# Altium project Capstone Control Board.PrjPcb
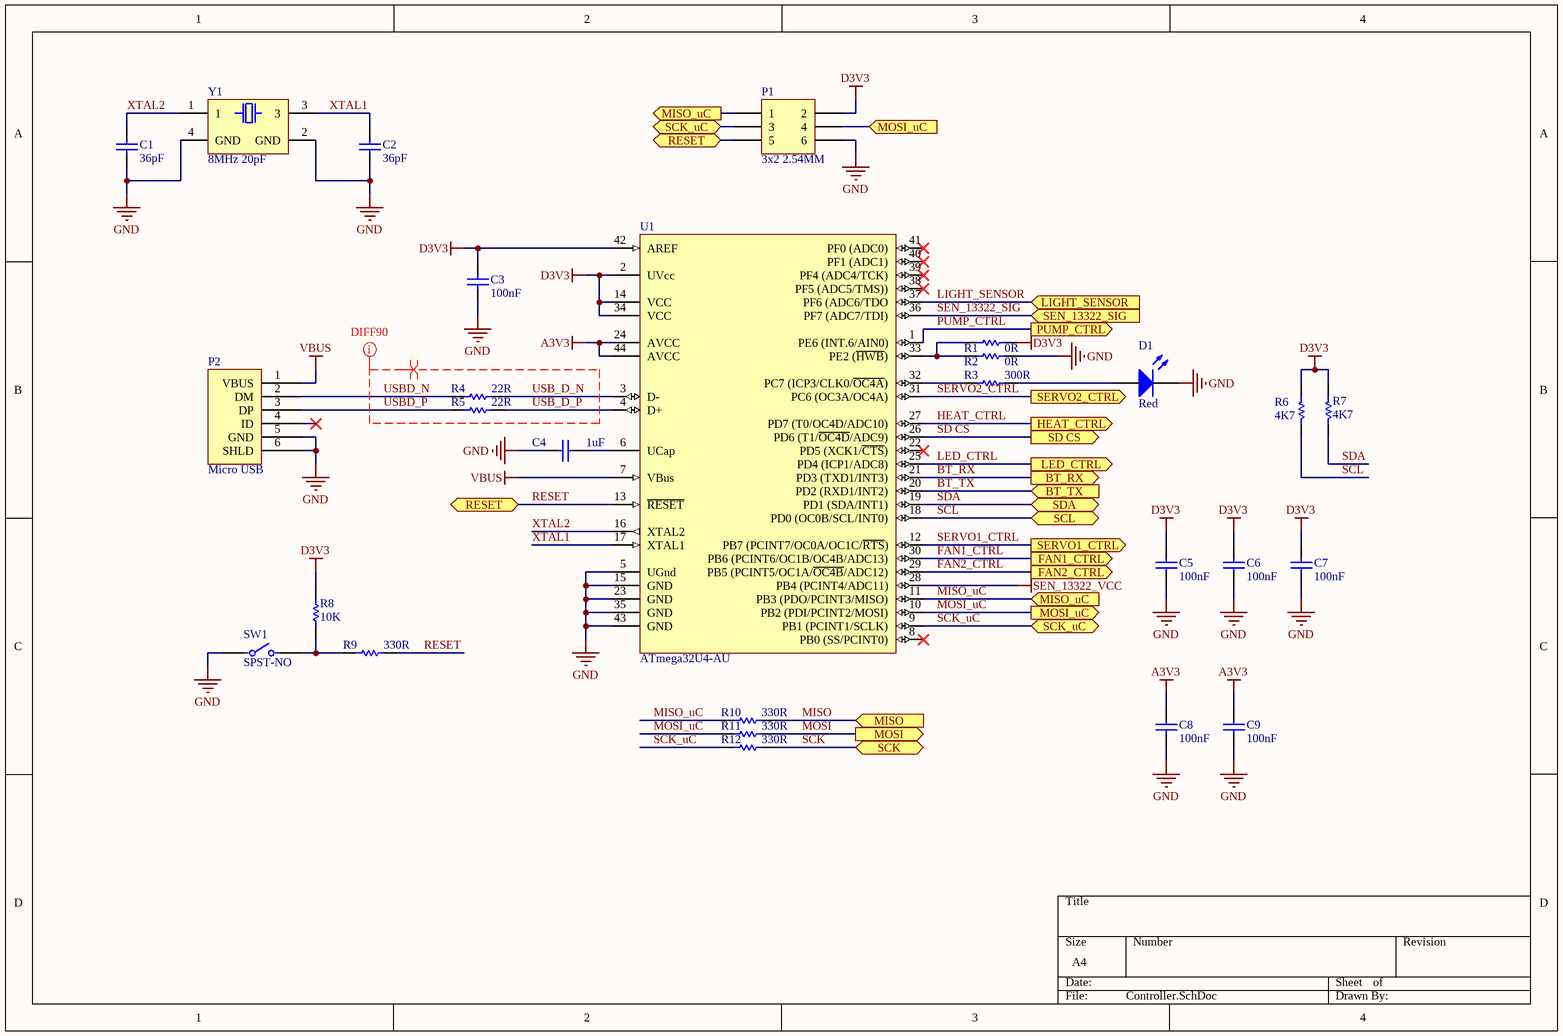
[diagram p0: Controller.SchDoc]
4 sheets, 100 parts. Net scope: flat (ports and power ports of the same name join across sheets).
Board file: Capstone Control Board.PcbDoc
Sheets:
  Controller.SchDoc
  Peripherals.SchDoc
  Sensors.SchDoc
  Power.SchDoc

## Sheet Controller.SchDoc
size A4

### Parts
C1  36pF  [CAP0603]
C2  36pF  [CAP0603]
C3  100nF  [CAP0603]
C4  1uF  [CAP0603]
C5  100nF  [CAP0603]
C6  100nF  [CAP0603]
C7  100nF  [CAP0603]
C8  100nF  [CAP0603]
C9  100nF  [CAP0603]
D1  Red  [DIODE0603]
P1  3x2 2.54MM  [HDR2X3]
P2  Micro USB  [MOLEX MICRO USB PORT]
R1  0R  [RES0603]
R2  0R  [RES0603]
R3  300R  [RES0603]
R4  22R  [RES0603]
R5  22R  [RES0603]
R6  4K7  [RES0603]
R7  4K7  [RES0603]
R8  10K  [RES0603]
R9  330R  [RES0603]
R10  330R  [RES0603]
R11  330R  [RES0603]
R12  330R  [RES0603]
SW1  SPST-NO  [Tactile SPST-NO Switch]
U1  ATmega32U4-AU  [44ML_M]
Y1  8MHz 20pF  [3225 XTAL]

### Ports
BT_RX (out), BT_TX (in), FAN1_CTRL (out), FAN2_CTRL (out), HEAT_CTRL (out), LED_CTRL (out), LIGHT_SENSOR (in), MISO (in), MISO_uC (in), MISO_uC (out), MOSI (out), MOSI_uC (in), MOSI_uC (out), PUMP_CTRL (out), RESET (bidir), SCK (bidir), SCK_uC (bidir), SCL (bidir), SD CS (out), SDA (bidir), SEN_13322_SIG (in), SERVO1_CTRL (out), SERVO2_CTRL (out)

### Nets
A3V3: C8.2 C9.2 U1.24(AVCC) U1.44(AVCC)
D3V3: C3.2 C5.2 C6.2 C7.2 P1.2 R1.2 R6.2 R7.2 R8.2 U1.2(UVcc) U1.14(VCC) U1.34(VCC) U1.42(AREF)
GND: C1.1 C2.1 C3.1 C4.1 C5.1 C6.1 C7.1 C8.1 C9.1 D1.2(K) P1.6 P2.5(GND) P2.6(SHLD) R2.2 SW1.1 U1.5(UGnd) U1.15(GND) U1.23(GND) U1.35(GND) U1.43(GND) Y1.2(GND) Y1.4(GND)
SEN_13322_VCC: U1.28(PB4_(PCINT4/ADC11))
VBUS: P2.1(VBUS) U1.7(VBus)
BT_RX: U1.21(PD3_(TXD1/INT3)) ; port BT_RX
BT_TX: U1.20(PD2_(RXD1/INT2)) ; port BT_TX
FAN1_CTRL: U1.30(PB6_(PCINT6/OC1B/OC4B/ADC13)) ; port FAN1_CTRL
FAN2_CTRL: U1.29(PB5_(PCINT5/OC1A/~{OC4B}/ADC12)) ; port FAN2_CTRL
HEAT_CTRL: U1.27(PD7_(T0/OC4D/ADC10)) ; port HEAT_CTRL
LED_CTRL: U1.25(PD4_(ICP1/ADC8)) ; port LED_CTRL
LIGHT_SENSOR: U1.37(PF6_(ADC6/TDO) ; port LIGHT_SENSOR
MISO: R10.1 ; port MISO
MISO_uC: P1.1 R10.2 U1.11(PB3_(PDO/PCINT3/MISO)) ; port MISO_uC
MOSI: R11.1 ; port MOSI
MOSI_uC: P1.4 R11.2 U1.10(PB2_(PDI/PCINT2/MOSI)) ; port MOSI_uC
PUMP_CTRL: U1.1(PE6_(INT.6/AIN0)) ; port PUMP_CTRL
RESET: P1.5 R9.1 U1.13(~{RESET}) ; port RESET
SCK: R12.1 ; port SCK
SCK_uC: P1.3 R12.2 U1.9(PB1_(PCINT1/SCLK)) ; port SCK_uC
SCL: R6.1 U1.18(PD0_(OC0B/SCL/INT0)) ; port SCL
SD CS: U1.26(PD6_(T1/~{OC4D}/ADC9)) ; port SD CS
SDA: R7.1 U1.19(PD1_(SDA/INT1)) ; port SDA
SEN_13322_SIG: U1.36(PF7_(ADC7/TDI)) ; port SEN_13322_SIG
SERVO1_CTRL: U1.12(PB7_(PCINT7/OC0A/OC1C/~{RTS})) ; port SERVO1_CTRL
SERVO2_CTRL: U1.31(PC6_(OC3A/OC4A)) ; port SERVO2_CTRL
USB_D_N: R4.2 U1.3(D-)
USB_D_P: R5.2 U1.4(D+)
USBD_N: P2.2(DM) R4.1
USBD_P: P2.3(DP) R5.1
XTAL1: C2.2 U1.17(XTAL1) Y1.3
XTAL2: C1.2 U1.16(XTAL2) Y1.1
NetC4_2: C4.2 U1.6(UCap)
NetD1_1: D1.1(A) R3.1
NetR1_1: R1.1 R2.1 U1.33(PE2_(~{HWB}))
NetR3_2: R3.2 U1.32(PC7_(ICP3/CLK0/~{OC4A}))
NetR8_1: R8.1 R9.2 SW1.2

Not connected (* = marked no-connect by the designer): P2 4(ID)*; U1 8(PB0_(SS/PCINT0))* 22(PD5_(XCK1/~{CTS}))* 38(PF5_(ADC5/TMS)))* 39(PF4_(ADC4/TCK))* 40(PF1_(ADC1))* 41(PF0_(ADC0))*

### Layout directives
differential pair: USB_D_N, USB_D_P, USBD_N, USBD_P
net class USB: USB_D_N, USB_D_P, USBD_N, USBD_P

### Library data of the parts
C1-C9 = Capacitor: Published: 8-Jun-2000; LatestRevisionDate: 17-Jul-2002; LatestRevisionNote: Re-released for DXP Platform.; PackageReference: RAD-0.3; Publisher: Altium Limited; PackageDescription: Radial Cap, Thru-Hole; 2 Leads; 0.3 in Pin Spacing; Value: Value
D1 = LED: Light Emitting Diode; Published: 8-Jun-2000; LatestRevisionDate: 17-Jul-2002; LatestRevisionNote: Re-released for DXP Platform.; PackageVersion: Sep-1996; PackageReference: SMC; Publisher: Altium Limited; PackageDescription: DO-214-AB/SMC; 2 C-Bend Leads; Body 7.9 x 5.9 mm, inc. leads (LxW); Code_JEDEC: DO-214-AB
P1 = 3x2 2.54MM: Header, 3-Pin, Dual row; LatestRevisionDate: 17-Jul-2002; LatestRevisionNote: Re-released for DXP Platform.; Publisher: Altium Limited
P2 = Micro USB Connector
R1-R12 = Resistor: Published: 8-Jun-2000; LatestRevisionDate: 17-Jul-2002; LatestRevisionNote: Re-released for DXP Platform.; PackageReference: AXIAL-0.3; Publisher: Altium Limited; PackageDescription: Axial Device, Thru-Hole; 2 Leads; 0.3 in Pin Spacing; Value: Value
SW1 = B3U-1000P-B: SPST-NO Switch SMD; Manufacturer: Omron; Operating Force: 1.5N; Voltage Rating Dc: 12V; Contact Current Rating: 50mA; Contact Resistance: 100mΩ; Electromechanical Life: 200000Cycles; Height: 1.75mm; Device Class L2: Switches; Temperature Range High: +70°C; Digikey Description: SWITCH TACTILE SPST-NO 0.05A 12V; Throw Configuration: SPST-NO; Ambient Temperature Range High: +70°C; Temperature: -25°C to +70°C; Lead Free: Yes; ComponentLink2URL: https://omronfs.omron.com/en_US/ecb/products/pdf/en-b3u.pdf; Device Class L3: Tactile Switches; Manufacturer Part Number: B3U-1000P-B; Ambient Temperature Range Low: -25°C; Mount: Surface Mount; Automotive: No; Mouser Description: Tactile Switches Top Actuated with boss w/o ground; Octopart: https://octopart.com/b3u-1000p-b-omron-1057356; RoHS: TRUE; Package: 0; Device Class L1: Electromechanical; Category: Switch; Temperature Range Low: -25°C; ComponentLink2Description: Datasheet
U1 = CMP-0095-00285-2: 8-bit AVR Microcontroller, 2.7-5.5V, 16MHz, 32KB Flash, 1KB EEPROM, 2.5KB SRAM, USB Controller, 44-pin TQFP, Industrial Grade (-40°C to 85°C), Ext Osc; RevisionNote: DatasheetVersion updated. URLs added.; ComponentLink1Description: Manufacturer URL; PackageDescription: 44-Pin Plastic Thin Quad Flat Pack, 10 x 10 x 1.0 mm Body, 0.8 mm Pitch (TQFP); DatasheetVersion: revF, Nov-2010; ComponentLink2URL: http://www.atmel.com/dyn/resources/prod_documents/doc7766.pdf; ComponentLink1URL: http://www.atmel.com/; PackageReference: 44ML; ComponentLink2Description: ATmega16U4/32U4 Datasheet; PackageVersion: rev.G, Jul-2007; ComponentLink3URL: http://www.atmel.com/dyn/resources/prod_documents/7766S.pdf; ComponentLink3Description: ATmega16U4 ATmega32U4 Summary
Y1 = XTAL: 3225 XTAL; MP: TSX-3225 16.0000MF18X-AC3; MF: EPSON; Availability: Unavailable; Package: SMD-4 Epson; SnapEDA_Link: https://www.snapeda.com/parts/TSX-3225%2016.0000MF18X-AC3/EPSON/view-part/105674/?ref=snap; Value: *; Price: None

## Sheet Peripherals.SchDoc
size A4
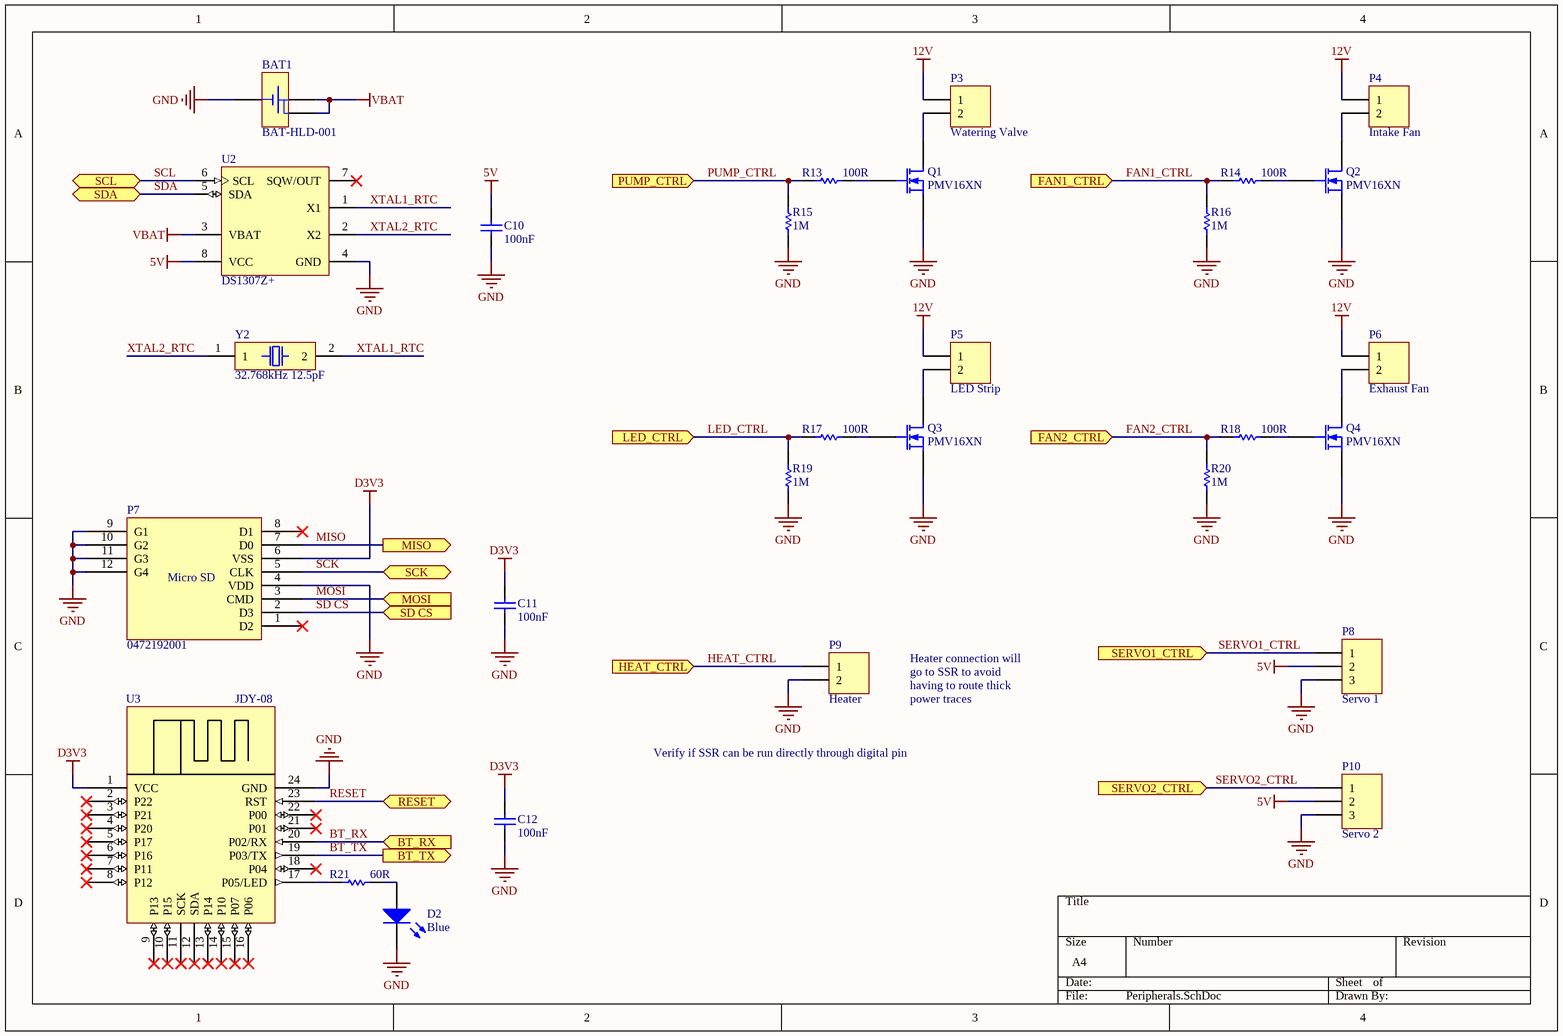
[diagram p1: Peripherals.SchDoc]

### Parts
BAT1  BAT-HLD-001  [BATHLD-001]
C10  100nF  [CAP0603]
C11  100nF  [CAP0603]
C12  100nF  [CAP0603]
D2  Blue  [DIODE0603]
P3  Watering Valve  [MOLEX MICROLATCH 2CT]
P4  Intake Fan  [MOLEX MICROLATCH 2CT]
P5  LED Strip  [MOLEX MICROLATCH 2CT]
P6  Exhaust Fan  [MOLEX MICROLATCH 2CT]
P7  0472192001  [MOLEX MICRO SD]
P8  Servo 1  [MOLEX MICROLATCH 3CT]
P9  Heater  [MOLEX MICROLATCH 2CT]
P10  Servo 2  [MOLEX MICROLATCH 3CT]
Q1  PMV16XN  [SOT-23]
Q2  PMV16XN  [SOT-23]
Q3  PMV16XN  [SOT-23]
Q4  PMV16XN  [SOT-23]
R13  100R  [RES0603]
R14  100R  [RES0603]
R15  1M  [RES0603]
R16  1M  [RES0603]
R17  100R  [RES0603]
R18  100R  [RES0603]
R19  1M  [RES0603]
R20  1M  [RES0603]
R21  60R  [RES0603]
U2  DS1307Z+  [SOIC8 150mil]
U3  JDY-08  [JDY-08]
Y2  32.768kHz 12.5pF  [3210 XTAL]

### Ports
BT_RX (in), BT_TX (out), FAN1_CTRL (in), FAN2_CTRL (in), HEAT_CTRL (in), LED_CTRL (in), MISO (out), MOSI (in), PUMP_CTRL (in), RESET (bidir), SCK (bidir), SCL (bidir), SD CS (in), SDA (bidir), SERVO1_CTRL (in), SERVO2_CTRL (in)

### Nets
5V: C10.2 P8.2 P10.2 U2.8(VCC)
12V: P3.1 P4.1 P5.1 P6.1
D3V3: C11.2 C12.2 P7.6(VSS) U3.1(VCC)
GND: BAT1.1(-) C10.1 C11.1 C12.1 D2.2(K) P7.4(VDD) P7.9(G1) P7.10(G2) P7.11(G3) P7.12(G4) P8.3 P9.2 P10.3 Q1.2(S) Q2.2(S) Q3.2(S) Q4.2(S) R15.2 R16.2 R19.2 R20.2 U2.4(GND) U3.24(GND)
VBAT: BAT1.2(+) BAT1.3(+) U2.3(VBAT)
BT_RX: U3.20(P02/RX) ; port BT_RX
BT_TX: U3.19(P03/TX) ; port BT_TX
FAN1_CTRL: R14.2 R16.1 ; port FAN1_CTRL
FAN2_CTRL: R18.2 R20.1 ; port FAN2_CTRL
HEAT_CTRL: P9.1 ; port HEAT_CTRL
LED_CTRL: R17.2 R19.1 ; port LED_CTRL
MISO: P7.7(D0) ; port MISO
MOSI: P7.3(CMD) ; port MOSI
PUMP_CTRL: R13.2 R15.1 ; port PUMP_CTRL
RESET: U3.23(RST) ; port RESET
SCK: P7.5(CLK) ; port SCK
SCL: U2.6(SCL) ; port SCL
SD CS: P7.2(D3) ; port SD CS
SDA: U2.5(SDA) ; port SDA
SERVO1_CTRL: P8.1 ; port SERVO1_CTRL
SERVO2_CTRL: P10.1 ; port SERVO2_CTRL
XTAL1_RTC: U2.1(X1) Y2.2
XTAL2_RTC: U2.2(X2) Y2.1
NetD2_1: D2.1(A) R21.1
NetP3_2: P3.2 Q1.3(D)
NetP4_2: P4.2 Q2.3(D)
NetP5_2: P5.2 Q3.3(D)
NetP6_2: P6.2 Q4.3(D)
NetQ1_1: Q1.1(G) R13.1
NetQ2_1: Q2.1(G) R14.1
NetQ3_1: Q3.1(G) R17.1
NetQ4_1: Q4.1(G) R18.1
NetR21_2: R21.2 U3.17(P05/LED)

Not connected (* = marked no-connect by the designer): P7 1(D2)* 8(D1)*; U2 7(SQW/OUT)*; U3 2(P22)* 3(P21)* 4(P20)* 5(P17)* 6(P16)* 7(P11)* 8(P12)* 9(P13)* 10(P15)* 11(SCK)* 12(SDA)* 13(P14)* 14(P10)* 15(P07)* 16(P06)* 18(P04)* 21(P01)* 22(P00)*

### Notes on the sheet
- Heater connection will
- go to SSR to avoid
- having to route thick
- power traces
- Verify if SSR can be run directly through digital pin
- (in symbol Micro SD Card) Micro SD

### Library data of the parts
BAT1 = CMP-0168-00043-1: 20mm Coin Cell Battery Holder; PCB_Layout: Complies with manufacturer's recommendation.; DatasheetVersion: rev1.0, Dec-2007; PackageVersion: rev1.0, Dec-2007; PackageReference: BATHLD-001; PackageDescription: Low Profile SM Battery Holder, 20mm Lithium Cell, 21.1 x 15.3 x 4.2 mm Body
C10-C12 = Capacitor: Published: 8-Jun-2000; LatestRevisionDate: 17-Jul-2002; LatestRevisionNote: Re-released for DXP Platform.; PackageReference: RAD-0.3; Publisher: Altium Limited; PackageDescription: Radial Cap, Thru-Hole; 2 Leads; 0.3 in Pin Spacing; Value: Value
D2 = LED: Light Emitting Diode; Published: 8-Jun-2000; LatestRevisionDate: 17-Jul-2002; LatestRevisionNote: Re-released for DXP Platform.; PackageVersion: Sep-1996; PackageReference: SMC; Publisher: Altium Limited; PackageDescription: DO-214-AB/SMC; 2 C-Bend Leads; Body 7.9 x 5.9 mm, inc. leads (LxW); Code_JEDEC: DO-214-AB
P3-P6 P9 = 2X1 2.54MM: Header, 2-Pin; LatestRevisionDate: 17-Jul-2002; LatestRevisionNote: Re-released for DXP Platform.; Publisher: Altium Limited
P7 = Micro SD Card
P8 P10 = 3X1 2.54MM: Header, 3-Pin; LatestRevisionDate: 17-Jul-2002; LatestRevisionNote: Re-released for DXP Platform.; Publisher: Altium Limited
Q1-Q4 = MOSFET-N: N-Channel MOSFET; Published: 8-Jun-2000; LatestRevisionDate: 17-Jul-2002; LatestRevisionNote: Re-released for DXP Platform.; PackageVersion: 1995/1996; PackageReference: E3; Publisher: Altium Limited; PackageDescription: TO, Flat Index; 3 In-Line, Axial Leads; Body Dia. 4.6mm; Lead Dia. 0.5 mm (max)
R13-R21 = Resistor: Published: 8-Jun-2000; LatestRevisionDate: 17-Jul-2002; LatestRevisionNote: Re-released for DXP Platform.; PackageReference: AXIAL-0.3; Publisher: Altium Limited; PackageDescription: Axial Device, Thru-Hole; 2 Leads; 0.3 in Pin Spacing; Value: Value
U2 = DS1307Z+: 64 x 8, Serial, I2C Real-Time Clock, 5.0V, 8-Pin SO, 0 to 70 degC, Pb-Free; ComponentLink3Description: Package Specification; DatasheetVersion: 10-Feb-2008; Code_IPC: SOIC127P600-8; ComponentLink2Description: Datasheet; Code_JEDEC: MS-012-AA; ComponentLink2URL: http://datasheets.maxim-ic.com/en/ds/DS1307.pdf; ComponentLink3URL: http://pdfserv.maxim-ic.com/package_dwgs/21-0041.PDF; ComponentLink1URL: http://www.maxim-ic.com; PackageReference: S8+2; ComponentLink1Description: Manufacturer URL; PackageDescription: 8-Pin Small-Outline IC, Narrow (0.15in), 1.27 mm Pitch, SOIC (N), Pb-Free; PackageVersion: revC, 2010
U3 = JDY-08: HM-11 JDY-08 Bluetooth module
Y2 = XTAL 3210

## Sheet Sensors.SchDoc
size A4
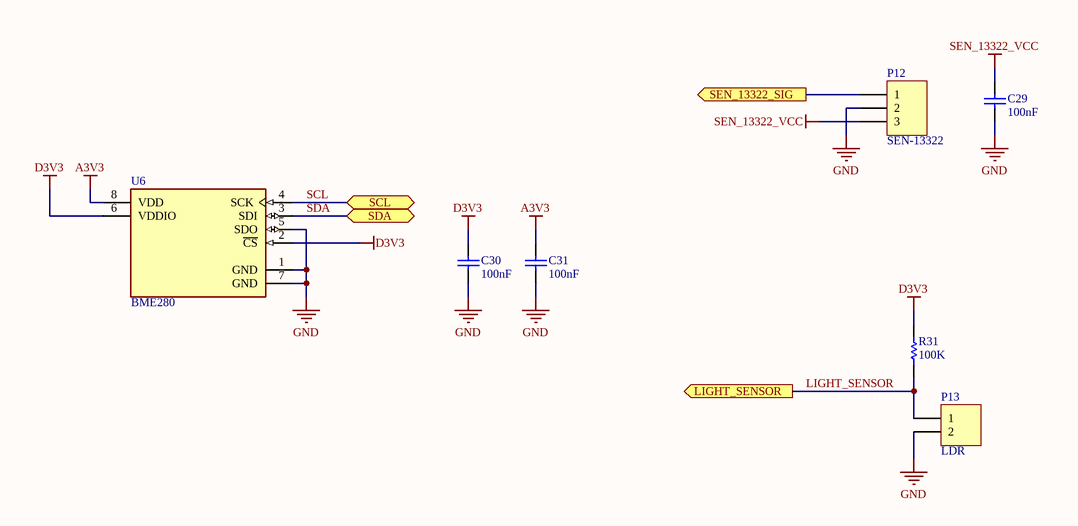
[diagram p2: Sensors.SchDoc]

### Parts
C29  100nF  [CAP0603]
C30  100nF  [CAP0603]
C31  100nF  [CAP0603]
P12  SEN-13322  [MOLEX MICROLATCH 3CT]
P13  LDR  [MOLEX MICROLATCH 2CT]
R31  100K  [RES0603]
U6  BME280  [BME280]

### Ports
LIGHT_SENSOR (out), SCL (bidir), SDA (bidir), SEN_13322_SIG (out)

### Nets
A3V3: C31.2 U6.8(VDD)
D3V3: C30.2 R31.2 U6.2(~{CS}) U6.6(VDDIO)
GND: C29.1 C30.1 C31.1 P12.2 P13.2 U6.1(GND) U6.5(SDO) U6.7(GND)
SEN_13322_VCC: C29.2 P12.3
LIGHT_SENSOR: P13.1 R31.1 ; port LIGHT_SENSOR
SCL: U6.4(SCK) ; port SCL
SDA: U6.3(SDI) ; port SDA
SEN_13322_SIG: P12.1 ; port SEN_13322_SIG

### Library data of the parts
C29-C31 = Capacitor: Published: 8-Jun-2000; LatestRevisionDate: 17-Jul-2002; LatestRevisionNote: Re-released for DXP Platform.; PackageReference: RAD-0.3; Publisher: Altium Limited; PackageDescription: Radial Cap, Thru-Hole; 2 Leads; 0.3 in Pin Spacing; Value: Value
P12 = 3X1 2.54MM: Header, 3-Pin; LatestRevisionDate: 17-Jul-2002; LatestRevisionNote: Re-released for DXP Platform.; Publisher: Altium Limited
P13 = 2X1 2.54MM: Header, 2-Pin; LatestRevisionDate: 17-Jul-2002; LatestRevisionNote: Re-released for DXP Platform.; Publisher: Altium Limited
R31 = Resistor: Published: 8-Jun-2000; LatestRevisionDate: 17-Jul-2002; LatestRevisionNote: Re-released for DXP Platform.; PackageReference: AXIAL-0.3; Publisher: Altium Limited; PackageDescription: Axial Device, Thru-Hole; 2 Leads; 0.3 in Pin Spacing; Value: Value
U6 = BME280: SENSOR PRESSURE HUMIDITY TEMP; Sensor Type: Temperature; Accuracy: 3%; Response Time: 1s; Output Type: SPI; Min Operating Temperature: -40°C; Max Operating Temperature: 85°C; Case/Package: LGA; Packaging: Cut Tape; Mount: Surface Mount; Lead Free: Lead Free; Number of Pins: 8

## Sheet Power.SchDoc
size A4
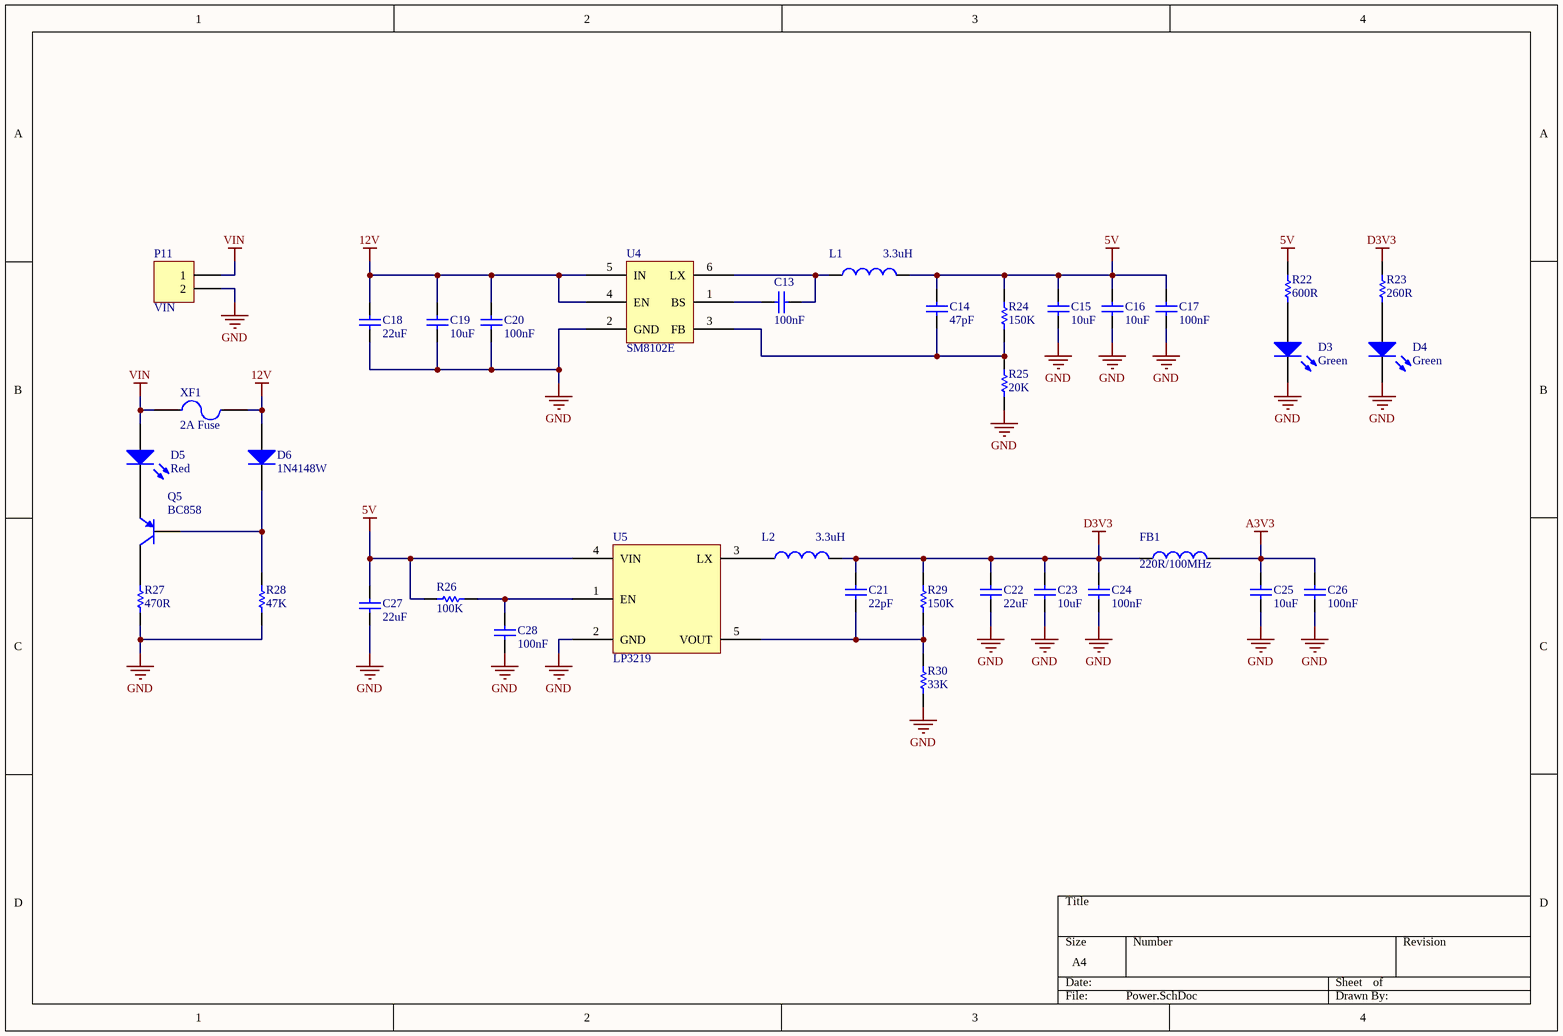
[diagram p3: Power.SchDoc]

### Parts
C13  100nF  [CAP0603]
C14  47pF  [CAP0603]
C15  10uF  [CAP0805]
C16  10uF  [CAP0805]
C17  100nF  [CAP0603]
C18  22uF  [CAP0805]
C19  10uF  [CAP0805]
C20  100nF  [CAP0603]
C21  22pF  [CAP0603]
C22  22uF  [CAP0805]
C23  10uF  [CAP0805]
C24  100nF  [CAP0603]
C25  10uF  [CAP0805]
C26  100nF  [CAP0603]
C27  22uF  [CAP0805]
C28  100nF  [CAP0603]
D3  Green  [DIODE0603]
D4  Green  [DIODE0603]
D5  Red  [DIODE0603]
D6  1N4148W  [SOD-123]
FB1  220R/100MHz  [IND0603]
L1  3.3uH  [IND4x4x1.8]
L2  3.3uH  [IND4x4x1.8]
P11  VIN  [SCREW TERMINAL 5MM]
Q5  BC858  [SOT-23]
R22  600R  [RES0603]
R23  260R  [RES0603]
R24  150K  [RES0603]
R25  20K  [RES0603]
R26  100K  [RES0603]
R27  470R  [RES0603]
R28  47K  [RES0603]
R29  150K  [RES0603]
R30  33K  [RES0603]
U4  SM8102E  [SOT-23-6]
U5  LP3219  [SOT-23-5]
XF1  2A Fuse  [ATO Fuse Holder SMD]

### Nets
5V: C14.2 C15.2 C16.2 C17.2 C27.2 L1.2 R22.2 R24.2 R26.2 U5.4(VIN)
12V: C18.2 C19.2 C20.2 D6.1(A) U4.4(EN) U4.5(IN) XF1.2
A3V3: C25.2 C26.2 FB1.2
D3V3: C21.2 C22.2 C23.2 C24.2 FB1.1 L2.2 R23.2 R29.2
GND: C15.1 C16.1 C17.1 C18.1 C19.1 C20.1 C22.1 C23.1 C24.1 C25.1 C26.1 C27.1 C28.1 D3.2(K) D4.2(K) P11.2 R25.1 R27.1 R28.1 R30.1 U4.2(GND) U5.2(GND)
VIN: D5.1(A) P11.1 XF1.1
NetC13_1: C13.1 L1.1 U4.6(LX)
NetC13_2: C13.2 U4.1(BS)
NetC14_1: C14.1 R24.1 R25.2 U4.3(FB)
NetC21_1: C21.1 R29.1 R30.2 U5.5(VOUT)
NetC28_2: C28.2 R26.1 U5.1(EN)
NetD3_1: D3.1(A) R22.1
NetD4_1: D4.1(A) R23.1
NetD5_2: D5.2(K) Q5.2(E)
NetD6_2: D6.2(K) Q5.1(B) R28.2
NetL2_1: L2.1 U5.3(LX)
NetQ5_3: Q5.3(C) R27.2

### Library data of the parts
C13-C28 = Capacitor: Published: 8-Jun-2000; LatestRevisionDate: 17-Jul-2002; LatestRevisionNote: Re-released for DXP Platform.; PackageReference: RAD-0.3; Publisher: Altium Limited; PackageDescription: Radial Cap, Thru-Hole; 2 Leads; 0.3 in Pin Spacing; Value: Value
D3-D5 = LED: Light Emitting Diode; Published: 8-Jun-2000; LatestRevisionDate: 17-Jul-2002; LatestRevisionNote: Re-released for DXP Platform.; PackageVersion: Sep-1996; PackageReference: SMC; Publisher: Altium Limited; PackageDescription: DO-214-AB/SMC; 2 C-Bend Leads; Body 7.9 x 5.9 mm, inc. leads (LxW); Code_JEDEC: DO-214-AB
D6 = Diode
FB1 = Inductor: Ferrite Bead; Code_IEC: 1005; Published: 8-Jun-2000; LatestRevisionDate: 29-May-2009; LatestRevisionNote: IPC-7351 Footprint Added.; PackageReference: 0402-A; Publisher: Altium Limited; PackageDescription: Chip Inductor; Code_JEITA: 0402; Value: Value
L1 L2 = Inductor: Code_IEC: 1005; Published: 8-Jun-2000; LatestRevisionDate: 29-May-2009; LatestRevisionNote: IPC-7351 Footprint Added.; PackageReference: 0402-A; Publisher: Altium Limited; PackageDescription: Chip Inductor; Code_JEITA: 0402; Value: 3.3uH
P11 = 2X1 2.54MM: Header, 2-Pin; LatestRevisionDate: 17-Jul-2002; LatestRevisionNote: Re-released for DXP Platform.; Publisher: Altium Limited
Q5 = PNP: PNP Bipolar Transistor; Published: 8-Jun-2000; LatestRevisionDate: 29-May-2009; LatestRevisionNote: IPC-7351 Footprint Added.; PackageVersion: Aug-1999; PackageReference: SOT-23B; Publisher: Altium Limited; PackageDescription: 3-Pin SOT-23 Package 0.95 mm Pitch, 2.4 mm Lead Span
R22-R30 = Resistor: Published: 8-Jun-2000; LatestRevisionDate: 17-Jul-2002; LatestRevisionNote: Re-released for DXP Platform.; PackageReference: AXIAL-0.3; Publisher: Altium Limited; PackageDescription: Axial Device, Thru-Hole; 2 Leads; 0.3 in Pin Spacing; Value: Value
U4 = SM8102E: Adjustable VREG
U5 = LP3219: ADJ 1.5A buck convertor
XF1 = ATO Fuse Holder: Automotive Fuse Holder

## Nets that join several sheets
5V: Peripherals (C10.2 P8.2 P10.2 U2.8), Power (10 pins)
12V: Peripherals (P3.1 P4.1 P5.1 P6.1), Power (7 pins)
A3V3: Controller (C8.2 C9.2 U1.24 U1.44), Sensors (C31.2 U6.8), Power (C25.2 C26.2 FB1.2)
D3V3: Controller (13 pins), Peripherals (C11.2 C12.2 P7.6 U3.1), Sensors (C30.2 R31.2 U6.2 U6.6), Power (8 pins)
GND: Controller (22 pins), Peripherals (23 pins), Sensors (8 pins), Power (22 pins)
SEN_13322_VCC: Controller (U1.28), Sensors (C29.2 P12.3)
BT_RX: Controller (U1.21), Peripherals (U3.20)
BT_TX: Controller (U1.20), Peripherals (U3.19)
FAN1_CTRL: Controller (U1.30), Peripherals (R14.2 R16.1)
FAN2_CTRL: Controller (U1.29), Peripherals (R18.2 R20.1)
HEAT_CTRL: Controller (U1.27), Peripherals (P9.1)
LED_CTRL: Controller (U1.25), Peripherals (R17.2 R19.1)
LIGHT_SENSOR: Controller (U1.37), Sensors (P13.1 R31.1)
MISO: Controller (R10.1), Peripherals (P7.7)
MOSI: Controller (R11.1), Peripherals (P7.3)
PUMP_CTRL: Controller (U1.1), Peripherals (R13.2 R15.1)
RESET: Controller (P1.5 R9.1 U1.13), Peripherals (U3.23)
SCK: Controller (R12.1), Peripherals (P7.5)
SCL: Controller (R6.1 U1.18), Peripherals (U2.6), Sensors (U6.4)
SD CS: Controller (U1.26), Peripherals (P7.2)
SDA: Controller (R7.1 U1.19), Peripherals (U2.5), Sensors (U6.3)
SEN_13322_SIG: Controller (U1.36), Sensors (P12.1)
SERVO1_CTRL: Controller (U1.12), Peripherals (P8.1)
SERVO2_CTRL: Controller (U1.31), Peripherals (P10.1)